# Altium project Knattebol PCB.PrjPcb
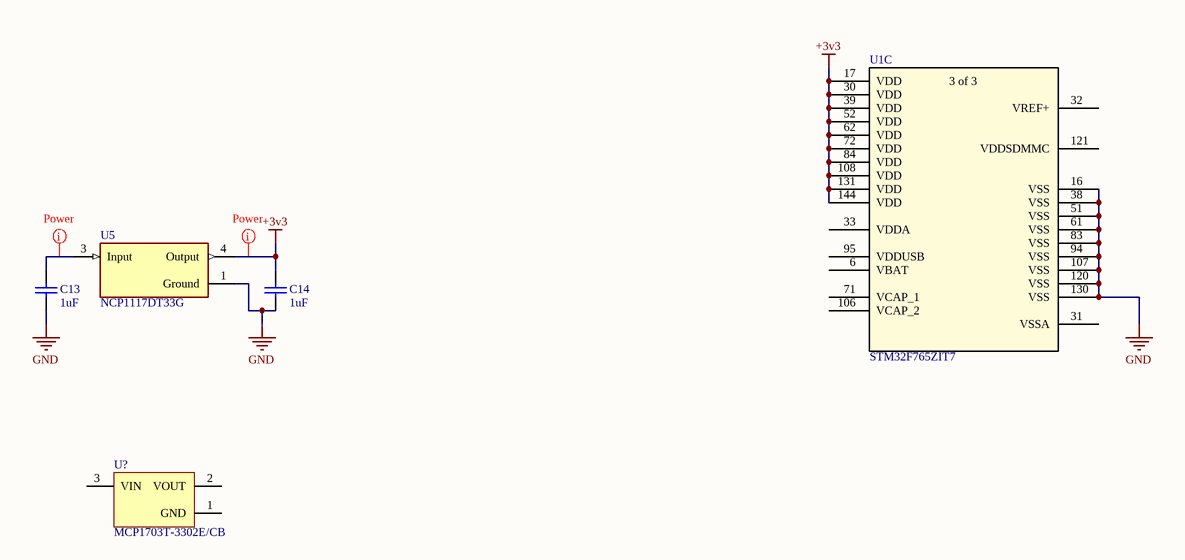
[diagram p0: Power.SchDoc]
3 sheets, 76 parts. Net scope: hierarchical (ports join the sheet entries above them; power ports are global).
Board file: PCB.PcbDoc
Sheets:
  Power.SchDoc
  Main.SchDoc
    DRV2 = Stepper-driver.SchDoc
    DRV3 = Stepper-driver.SchDoc
    DRV1 = Stepper-driver.SchDoc

## Sheet Power.SchDoc
size A4; SheetNumber: 3; SheetTotal: 3

### Parts
C13  1uF  [RAD-0.3]
C14  1uF  [RAD-0.3]
U1  STM32F765ZIT7  [LQFP-144_STM-M]  (part C of 3)
U5  NCP1117DT33G  [FP-369C-MFG]
U?  MCP1703T-3302E/CB  [SOT-23A-CB3_M]

### Nets
+3v3: C14.2 U1.17(VDD) U1.30(VDD) U1.39(VDD) U1.52(VDD) U1.62(VDD) U1.72(VDD) U1.84(VDD) U1.108(VDD) U1.131(VDD) U1.144(VDD) U5.4(Output)
GND: C13.1 C14.1 U1.16(VSS) U1.38(VSS) U1.51(VSS) U1.61(VSS) U1.83(VSS) U1.94(VSS) U1.107(VSS) U1.120(VSS) U1.130(VSS) U5.1(Ground)
NetC13_2: C13.2 U5.3(Input)

Not connected (* = marked no-connect by the designer): U1 6(VBAT) 31(VSSA) 32(VREF+) 33(VDDA) 71(VCAP_1) 95(VDDUSB) 106(VCAP_2) 121(VDDSDMMC); U? 1(GND) 2(VOUT) 3(VIN)

### Layout directives
net class Power; net class Power: NetC13_2
net class Power: +3v3

### Notes on the sheet
- (in symbol STM32F765ZIT7, part C) 3 of 3

### Library data of the parts
C13 C14 = Cap: Capacitor; Value: 100pF; Published: 8-Jun-2000; LatestRevisionDate: 17-Jul-2002; LatestRevisionNote: Re-released for DXP Platform.; PackageReference: RAD-0.3; Publisher: Altium Limited; PackageDescription: Radial Cap, Thru-Hole; 2 Leads; 0.3 in Pin Spacing
U1 = STM32F765ZIT7: No Description Available; Built_By: EMA_Jessica; Vendor: STMicroelectronics; SourceLibrary: Add_to_database_2020-10-19; Copyright: Copyright (C) 2018 Accelerated Designs. All rights reserved; Manufacturer_Part_Number: STM32F765ZIT7; RefDes: RefDes; Type: DEV
U5 = CMP-07128-000008-1: IC REG LINEAR 3.3V 1A DPAK; Manufacturer: ON Semiconductor; Dropout Voltage: 1.2V; Nominal Supply Current: 6mA; Number Of Outputs: 1; Max Supply Voltage: 20V; Max Junction Temp: +150°C; Min Supply Voltage: 2.4V; Accuracy Percentage: 1%; Output Type: Fixed; Standoff Height: 0mm; Package: 369C; Lead Free: Yes; Temperature Range Low: -55°C; Automotive: No; Digikey Description: IC REG LINEAR 3.3V 1A DPAK; ComponentLink2Description: Datasheet; Footprint Url: https://www.onsemi.com/pub/Collateral/369C.PDF; Output Voltage: 3.3V; Manufacturer Part Number: NCP1117DT33G; Device Class L2: Power Management ICs; RoHS: TRUE; Device Class L3: Voltage Regulators - Linear; Mouser Description: LDO Voltage Regulators 3.3V 1A Positive; Output Current: 1A; Ambient Temperature Range Low: 0°C; Height: 2.51mm; Octopart: https://octopart.com/ncp1117dt33g-on+semiconductor-1381653; Temperature Range High: +150°C; Temperature: -55°C to +150°C; Device Class L1: Integrated Circuits (ICs); ComponentLink2URL: https://www.onsemi.jp/PowerSolutions/document/NCP1117-D.PDF; Ambient Temperature Range High: +125°C; Category: IC
U? = CMP-0136-00759-1: 250 mA, 16V, Low Quiescent Current LDO Regulator, 3-Pin SOT-23A, Extended Temperature, Tape and Reel; PackageDescription: 3-Lead Plastic Small Outline Transistor (CB) [SOT-23A]; PackageVersion: revBB, Aug-2009; PackageReference: SOT-23A-CB3; DatasheetVersion: revD, Sep-2009

## Sheet Main.SchDoc
size 420 x 297 mm; SheetNumber: 2; SheetTotal: 2
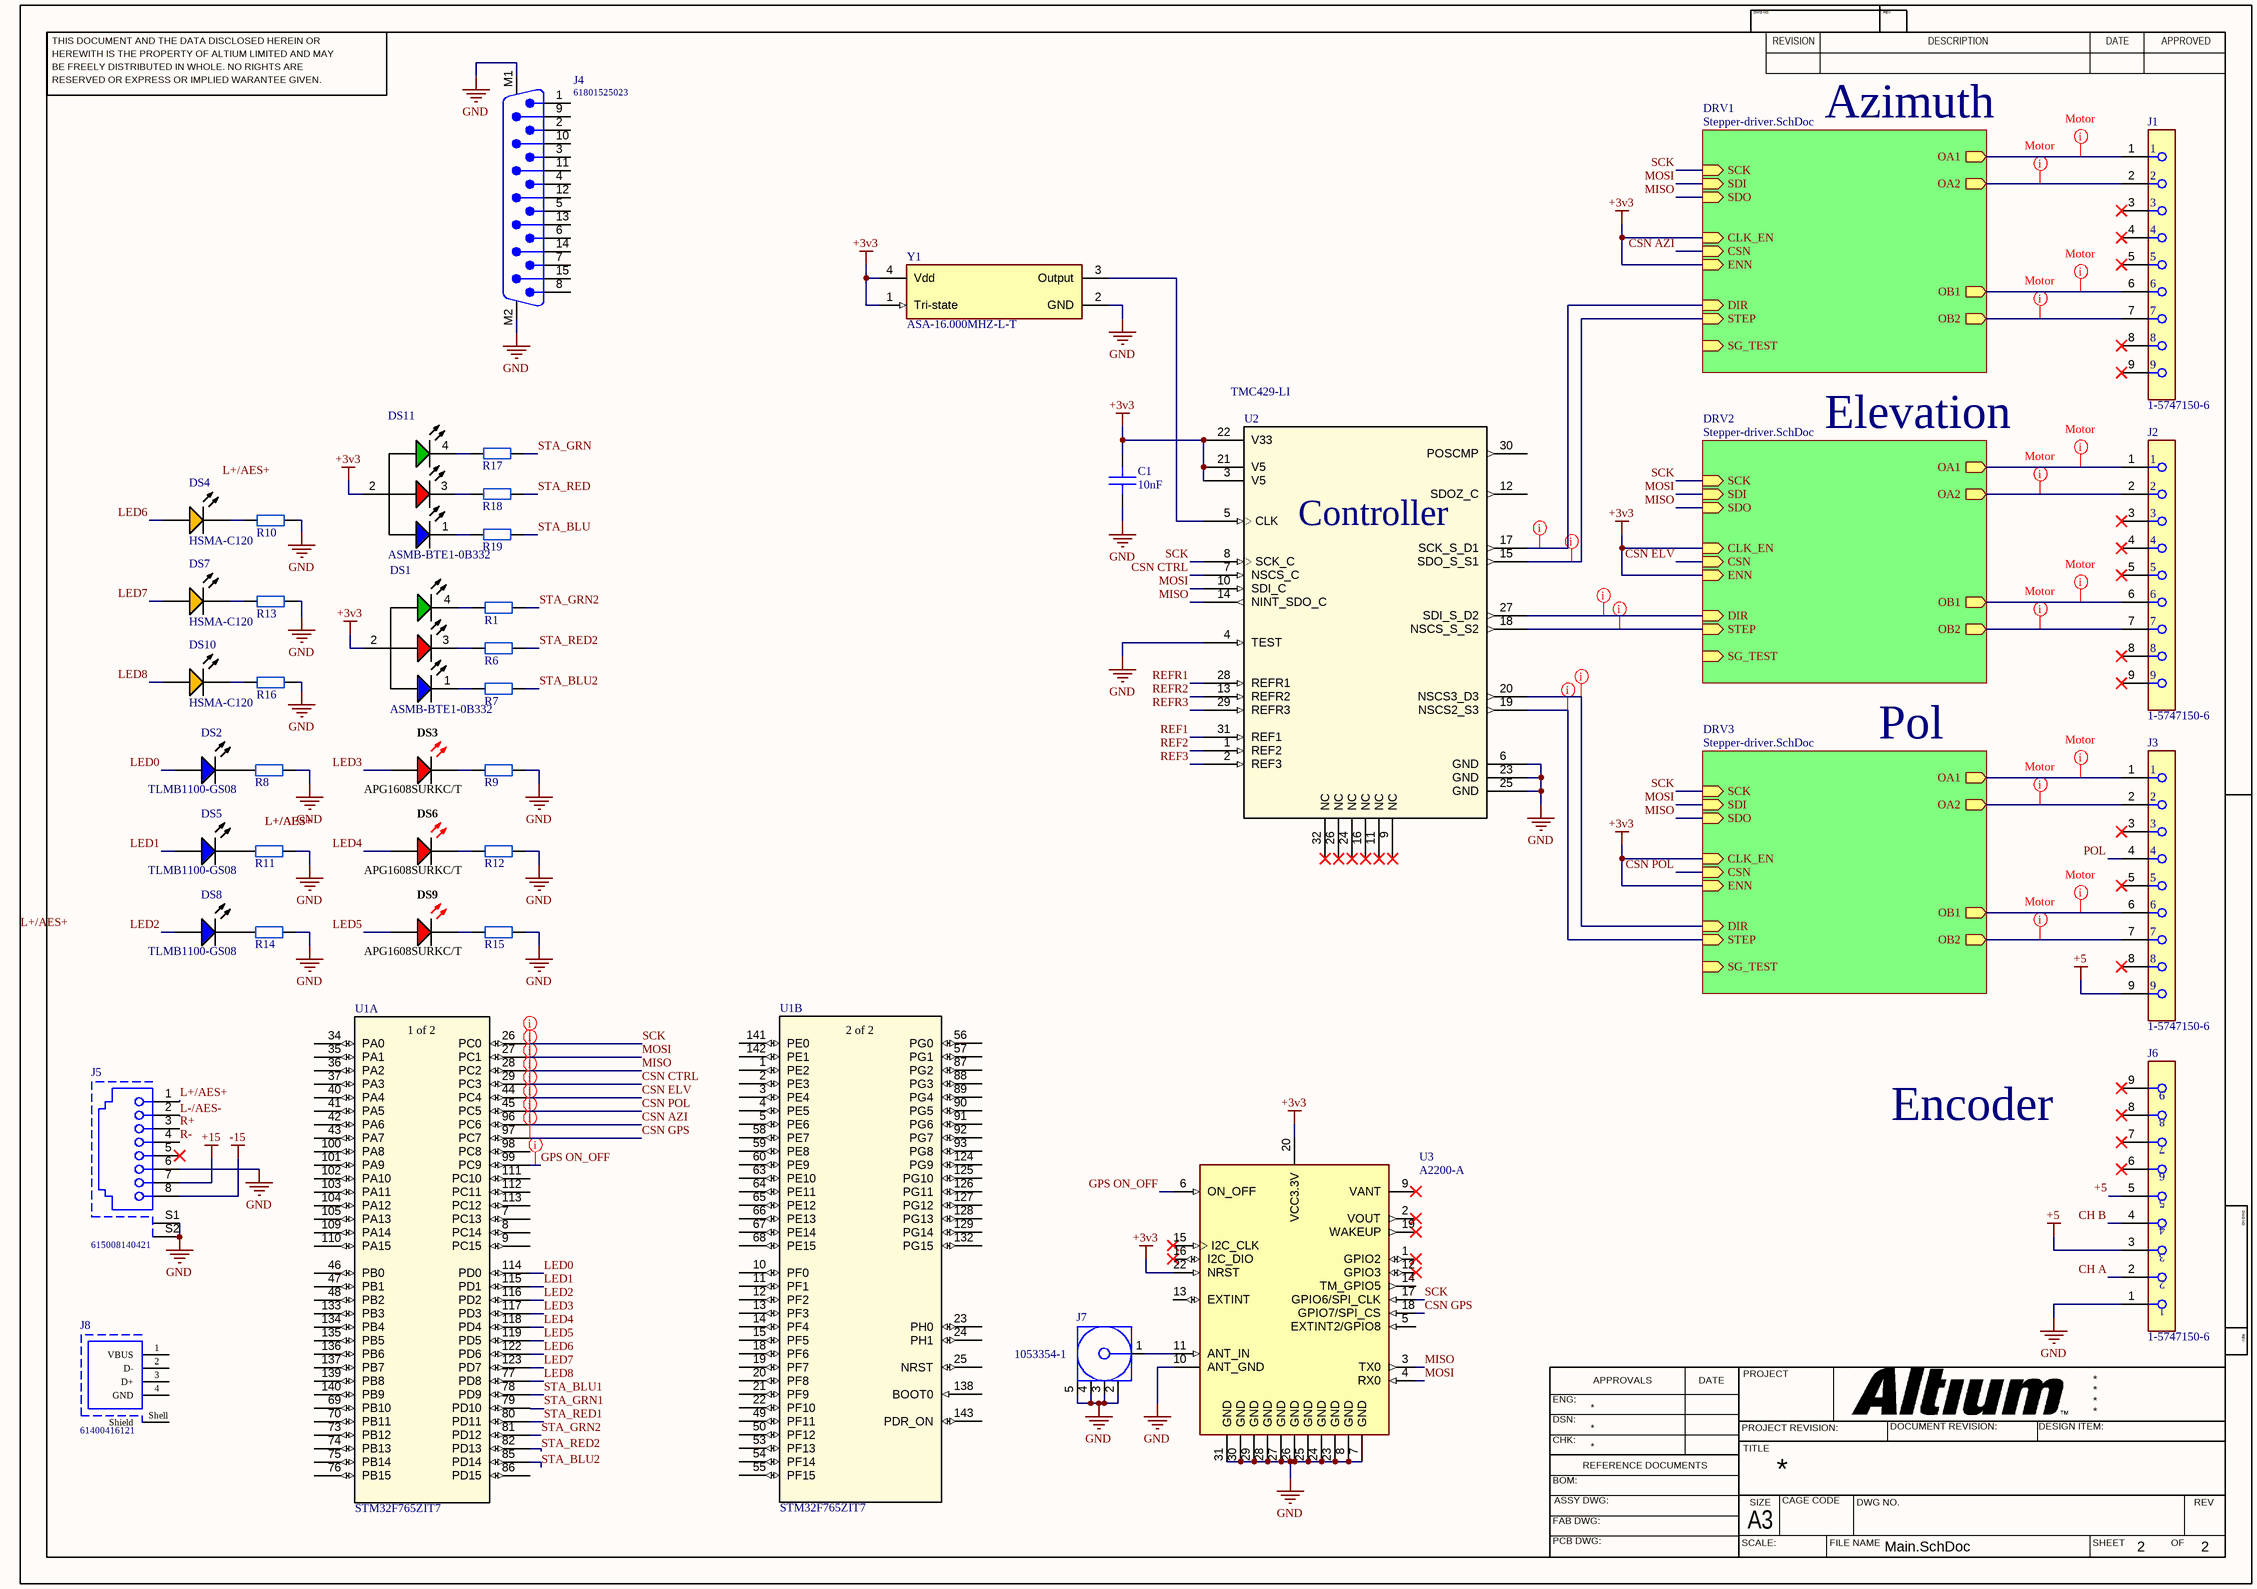
[diagram p1: Main.SchDoc]

### Parts
C1  value 10nF  [C0603 (1608)]  (hidden comment: Cap SMD)
DS1  ASMB-BTE1-0B332  [FP-ASMB-BTE1-0B332-MFG]
DS2  TLMB1100-GS08  [VISH-TLMX1100-2_V]
DS3  APG1608SURKC/T  [KING-LED0603-25-RED_V]
DS4  HSMA-C120  [AVAG-HSMA-C120-2_V]
DS5  TLMB1100-GS08  [VISH-TLMX1100-2_V]
DS6  APG1608SURKC/T  [KING-LED0603-25-RED_V]
DS7  HSMA-C120  [AVAG-HSMA-C120-2_V]
DS8  TLMB1100-GS08  [VISH-TLMX1100-2_V]
DS9  APG1608SURKC/T  [KING-LED0603-25-RED_V]
DS10  HSMA-C120  [AVAG-HSMA-C120-2_V]
DS11  ASMB-BTE1-0B332  [FP-ASMB-BTE1-0B332-MFG]
J1  1-5747150-6  [FP-1-5747150-6-MFG]
J2  1-5747150-6  [FP-1-5747150-6-MFG]
J3  1-5747150-6  [FP-1-5747150-6-MFG]
J4  61801525023  [61801525023]
J5  615008140421  [615008140421]
J6  1-5747150-6  [FP-1-5747150-6-MFG]
J7  1053354-1  [TECO-1053354-1_V]
J8  61400416121  [61400416121]
R1  Res  [R0603 (1608)]  (value not drawn)
R6  Res  [R0603 (1608)]  (value not drawn)
R7  Res  [R0603 (1608)]  (value not drawn)
R8  Res  [R0603 (1608)]  (value not drawn)
R9  Res  [R0603 (1608)]  (value not drawn)
R10  Res  [R0603 (1608)]  (value not drawn)
R11  Res  [R0603 (1608)]  (value not drawn)
R12  Res  [R0603 (1608)]  (value not drawn)
R13  Res  [R0603 (1608)]  (value not drawn)
R14  Res  [R0603 (1608)]  (value not drawn)
R15  Res  [R0603 (1608)]  (value not drawn)
R16  Res  [R0603 (1608)]  (value not drawn)
R17  Res  [R0603 (1608)]  (value not drawn)
R18  Res  [R0603 (1608)]  (value not drawn)
R19  Res  [R0603 (1608)]  (value not drawn)
U1  STM32F765ZIT7  [LQFP-144_STM-M]  (parts A,B of 3)
U2  TMC429-LI  [QFN32_5X5_TRI-M]
U3  A2200-A  [XCVR_A2200-A]
Y1  ASA-16.000MHZ-L-T  [FP-ASA-MFG]

### Sub-sheets
DRV1 = Stepper-driver.SchDoc: OA1 (out), OA2 (out), OB1 (out), OB2 (out), SCK (in), SDI (in), SDO (in), CSN (in), ENN (in), DIR (in), STEP (in), SG_TEST (in), CLK_EN (in)
DRV2 = Stepper-driver.SchDoc: OA1 (out), OA2 (out), OB1 (out), OB2 (out), SCK (in), SDI (in), SDO (in), CSN (in), ENN (in), DIR (in), STEP (in), SG_TEST (in), CLK_EN (in)
DRV3 = Stepper-driver.SchDoc: OA1 (out), OA2 (out), OB1 (out), OB2 (out), SCK (in), SDI (in), SDO (in), CSN (in), ENN (in), DIR (in), STEP (in), SG_TEST (in), CLK_EN (in)

### Nets
+3v3: C1.2 DS1.2(Common_Anode) DS11.2(Common_Anode) U2.3(V5) U2.21(V5) U2.22(V33) U3.20(VCC3.3V) U3.22(NRST) Y1.1(Tri-state) Y1.4(Vdd) ; sheet DRV2/ENN, sheet DRV2/CLK_EN, sheet DRV3/ENN, sheet DRV3/CLK_EN, sheet DRV1/ENN, sheet DRV1/CLK_EN
+5: J3.9 J6.3 J6.5
+15: J5.7
-15: J5.8
GND: C1.1 J4.M1 J4.M2 J5.6 J5.S1 J5.S2 J6.1 J7.2 J7.3 J7.4 J7.5 R8.2 R9.2 R10.2 R11.2 R12.2 R13.2 R14.2 R15.2 R16.2 U2.4(TEST) U2.6(GND) U2.23(GND) U2.25(GND) U3.7(GND) U3.8(GND) U3.10(ANT_GND) U3.23(GND) U3.24(GND) U3.25(GND) U3.26(GND) U3.27(GND) U3.28(GND) U3.29(GND) U3.30(GND) U3.31(GND) Y1.2(GND)
CH A: J6.2
CH B: J6.4
CSN AZI: U1.96(PC6) ; sheet DRV1/CSN
CSN CTRL: U1.29(PC3) U2.7(NSCS_C)
CSN ELV: U1.44(PC4) ; sheet DRV2/CSN
CSN GPS: U1.97(PC7) U3.18(GPIO7/SPI_CS)
CSN POL: U1.45(PC5) ; sheet DRV3/CSN
GPS ON_OFF: U1.99(PC9) U3.6(ON_OFF)
L+/AES+: J5.1
L-/AES-: J5.2
LED0: DS2.1(A) U1.114(PD0)
LED1: DS5.1(A) U1.115(PD1)
LED2: DS8.1(A) U1.116(PD2)
LED3: DS3.1(A) U1.117(PD3)
LED4: DS6.1(A) U1.118(PD4)
LED5: DS9.1(A) U1.119(PD5)
LED6: DS4.1(A) U1.122(PD6)
LED7: DS7.1(A) U1.123(PD7)
LED8: DS10.1(A) U1.77(PD8)
MISO: U1.28(PC2) U2.14(NINT_SDO_C) U3.3(TX0) ; sheet DRV2/SDO, sheet DRV3/SDO, sheet DRV1/SDO
MOSI: U1.27(PC1) U2.10(SDI_C) U3.4(RX0) ; sheet DRV2/SDI, sheet DRV3/SDI, sheet DRV1/SDI
POL: J3.4
R+: J5.3
R-: J5.4
REF1: U2.31(REF1)
REF2: U2.1(REF2)
REF3: U2.2(REF3)
REFR1: U2.28(REFR1)
REFR2: U2.13(REFR2)
REFR3: U2.29(REFR3)
SCK: U1.26(PC0) U2.8(SCK_C) U3.17(GPIO6/SPI_CLK) ; sheet DRV2/SCK, sheet DRV3/SCK, sheet DRV1/SCK
STA_BLU: R19.2
STA_BLU1: U1.78(PD9)
STA_BLU2: R7.2 U1.85(PD14)
STA_GRN: R17.2
STA_GRN2: R1.2 U1.81(PD12)
STA_RED: R18.2
STA_RED1: U1.80(PD11)
STA_RED2: R6.2 U1.82(PD13)
NetDS1_1: DS1.1(Cathode(Blue)) R7.1
NetDS1_3: DS1.3(Cathode(Red)) R6.1
NetDS1_4: DS1.4(Cathode(Green)) R1.1
NetDS2_2: DS2.2(K) R8.1
NetDS3_2: DS3.2(K) R9.1
NetDS4_2: DS4.2(K) R10.1
NetDS5_2: DS5.2(K) R11.1
NetDS6_2: DS6.2(K) R12.1
NetDS7_2: DS7.2(K) R13.1
NetDS8_2: DS8.2(K) R14.1
NetDS9_2: DS9.2(K) R15.1
NetDS10_2: DS10.2(K) R16.1
NetDS11_1: DS11.1(Cathode(Blue)) R19.1
NetDS11_3: DS11.3(Cathode(Red)) R18.1
NetDS11_4: DS11.4(Cathode(Green)) R17.1
NetJ1_1: J1.1 ; sheet DRV1/OA1
NetJ1_2: J1.2 ; sheet DRV1/OA2
NetJ1_6: J1.6 ; sheet DRV1/OB1
NetJ1_7: J1.7 ; sheet DRV1/OB2
NetJ2_1: J2.1 ; sheet DRV2/OA1
NetJ2_2: J2.2 ; sheet DRV2/OA2
NetJ2_6: J2.6 ; sheet DRV2/OB1
NetJ2_7: J2.7 ; sheet DRV2/OB2
NetJ3_1: J3.1 ; sheet DRV3/OA1
NetJ3_2: J3.2 ; sheet DRV3/OA2
NetJ3_6: J3.6 ; sheet DRV3/OB1
NetJ3_7: J3.7 ; sheet DRV3/OB2
NetJ7_1: J7.1 U3.11(ANT_IN)
NetU2_5: U2.5(CLK) Y1.3(Output)
NetU2_15: U2.15(SDO_S_S1) ; sheet DRV1/STEP
NetU2_17: U2.17(SCK_S_D1) ; sheet DRV1/DIR
NetU2_18: U2.18(NSCS_S_S2) ; sheet DRV2/STEP
NetU2_19: U2.19(NSCS2_S3) ; sheet DRV3/STEP
NetU2_20: U2.20(NSCS3_D3) ; sheet DRV3/DIR
NetU2_27: U2.27(SDI_S_D2) ; sheet DRV2/DIR

Not connected (* = marked no-connect by the designer): J1 3* 4* 5* 8* 9*; J2 3* 4* 5* 8* 9*; J3 3* 5* 8*; J4 1 2 3 4 5 6 7 8 9 10 11 12 13 14 15; J5 5*; J6 6* 7* 8* 9*; J8 1(VBUS) 2(D-) 3(D+) 4(GND) Shell(Shield); U1 1(PE2) 2(PE3) 3(PE4) 4(PE5) 5(PE6) 7(PC13) 8(PC14) 9(PC15) 10(PF0) 11(PF1) 12(PF2) 13(PF3) 14(PF4) 15(PF5) 18(PF6) 19(PF7) 20(PF8) 21(PF9) 22(PF10) 23(PH0) 24(PH1) 25(NRST) 34(PA0) 35(PA1) 36(PA2) 37(PA3) 40(PA4) 41(PA5) 42(PA6) 43(PA7) 46(PB0) 47(PB1) 48(PB2) 49(PF11) 50(PF12) 53(PF13) 54(PF14) 55(PF15) 56(PG0) 57(PG1) 58(PE7) 59(PE8) 60(PE9) 63(PE10) 64(PE11) 65(PE12) 66(PE13) 67(PE14) 68(PE15) 69(PB10) 70(PB11) 73(PB12) 74(PB13) 75(PB14) 76(PB15) 79(PD10) 86(PD15) 87(PG2) 88(PG3) 89(PG4) 90(PG5) 91(PG6) 92(PG7) 93(PG8) 98(PC8) 100(PA8) 101(PA9) 102(PA10) 103(PA11) 104(PA12) 105(PA13) 109(PA14) 110(PA15) 111(PC10) 112(PC11) 113(PC12) 124(PG9) 125(PG10) 126(PG11) 127(PG12) 128(PG13) 129(PG14) 132(PG15) 133(PB3) 134(PB4) 135(PB5) 136(PB6) 137(PB7) 138(BOOT0) 139(PB8) 140(PB9) 141(PE0) 142(PE1) 143(PDR_ON); U2 9(NC)* 11(NC)* 12(SDOZ_C) 16(NC)* 24(NC)* 26(NC)* 30(POSCMP) 32(NC)*; U3 1(GPIO2)* 2(VOUT)* 5(EXTINT2/GPIO8) 9(VANT)* 12(GPIO3)* 13(EXTINT) 14(TM_GPIO5) 15(I2C_CLK)* 16(I2C_DIO)* 19(WAKEUP)*

### Layout directives
net class Motor: NetJ1_2, NetJ1_6, NetJ1_7, NetJ2_1, NetJ2_2, NetJ2_6, NetJ2_7, NetJ3_1, NetJ3_2, NetJ3_6, NetJ3_7
net class Power; net class Motor: NetJ1_1
net class Signal HS: CSN AZI, CSN CTRL, CSN ELV, CSN GPS, CSN POL, GPS ON_OFF, MISO, MOSI, NetU2_15, NetU2_17, NetU2_18, NetU2_19, NetU2_20, NetU2_27, SCK

### Notes on the sheet
- Azimuth
- Elevation
- (near U2) Controller
- Pol
- Encoder
- Labels drawn without touching a wire or pin: L+/AES+
- THIS DOCUMENT AND THE DATA DISCLOSED HEREIN OR
- HEREWITH IS THE PROPERTY OF ALTIUM LIMITED AND MAY
- DWG NO:
- REVISION
- REV:
- DESCRIPTION
- DATE
- APPROVED
- BE FREELY DISTRIBUTED IN WHOLE. NO RIGHTS ARE
- RESERVED OR EXPRESS OR IMPLIED WARANTEE GIVEN.
- ENG:
- APPROVALS
- PROJECT
- DSN:
- CHK:
- REFERENCE DOCUMENTS
- PROJECT REVISION:
- TITLE
- DOCUMENT REVISION:
- DESIGN ITEM:
- BOM:
- FAB DWG:
- PCB DWG:
- ASSY DWG:
- SCALE:
- A3
- SIZE
- CAGE CODE
- FILE NAME
- DWG NO.
- SHEET
- OF
- REV
- (in symbol STM32F765ZIT7, part A) 1 of 2
- (in symbol STM32F765ZIT7, part B) 2 of 2

### Library data of the parts
DS1 DS11 = ASMB-BTE1-0B332 RGB LED: LED RGB DIFFUSED 4PLCC SMD; Manufacturer: Broadcom; Led Orientation: Top View; Colour: Blue, Green, Red; Viewing Angle: 110°; Power Dissipation: 90/90/78mW; Forward Current: 20mA; Max Junction Temp: +110°C; Wavelength: 469/529/622nm; Luminous Intensity: 350/1500/630mcd; Forward Voltage: 3.1/3.1/2.1V; Reverse Voltage: 4V; Peak Emmision Wavelength: 464/521/629nm; Package: 0; Temperature Range High: +100°C; Device Class L1: Optoelectronics; Device Class L2: LEDs; Temperature Range Low: -40°C; Temperature: -40°C to +100°C; Category: Diode; Device Class L3: unset; Manufacturer Part Number: ASMB-BTE1-0B332; Digikey Description: LED RGB DIFFUSED 4PLCC SMD; Lead Free: Yes; ComponentLink2Description: Datasheet; RoHS: TRUE; Automotive: No; Height: 2.1mm; ComponentLink2URL: https://docs.broadcom.com/docs/AV02-4236EN; Octopart: https://octopart.com/asmb-bte1-0b332-broadcom-71127192
DS2 DS5 DS8 = CMP-1666-00028-1: Blue LED, 10 mA, 3.9 V, -40 to 100 degC, 2-Pin SMD (0603), RoHS, Tape and Reel; Tolerance: 10%; Voltage Rating: 100 V; Capacitance: 10 nF; Type (Capacitors): X7R; Case\Package: Radial; ComponentLink1Description: Manufacturer URL; REACH SVHC: No SVHC; Package Quantity: 500; PackageDescription: 2-Pin Surface Mount Device, Body 1.6 x 0.8 mm; Pins: 2; ComponentLink2URL: http://download.siliconexpert.com/pdfs/2016/8/7/12/43/26/667/vsh_/manual/379263299541529tlmb1100.pdf; RoHSCompliant: true; Lead Pitch: 2.54 mm; Height: 2.54 mm; DatasheetVersion: Rev. 2.7, 03/2016; Length: 5.33 mm; ComponentLink1URL: http://www.vishay.com/; Min Operating Temperature: -55 degC; PackageReference: 0603; Packaging: Bulk; ComponentLink2Description: Datasheet; Max Operating Temperature: 125 degC; Radiation Hardening: No; Width: 3.81 mm; Mount: Through Hole
DS3 DS6 DS9 = CMP-0404-00004-1: Ultra Thin Hyper Red SMD Chip LED Lamp, 2 to 2.5 V, -40 to 85 degC, Body 1.6 x 0.8 mm, 0.28 mm Thickness, RoHS, Tape and Reel; Manufacturer: Kingbright; Dice: Hyper Red (AlGaInP); IR (Max): 10 uA; Luminous Intensity mcd @ 20 mA (Min.): 55; Lens Type: Water Clear; Viewing Angle: 120; Luminous Intensity mcd @ 20 mA (Typ.): 110; ComponentLink2Description: Datasheet; ComponentLink3URL: http://www.kingbrightusa.com/images/catalog/SPEC/APG1608SURKC-T.pdf; Packing: Tape and Reel; Mounting Technology: Surface Mount; PackageVersion: Rev. V.5A; ComponentLink1Description: Manufacturer URL; ComponentLink2URL: http://www.kingbrightusa.com/images/catalog/SPEC/APG1608SURKC-T.pdf; ComponentLink3Description: Package Specification; PackageDescription: 2-Pin SMT, Body 1.6 x 0.8 mm, 0.28mm Thickness, Red; PackageReference: LED0603-25-RED; DatasheetVersion: Rev. V.5A; Operating Temperature: -40 to 85 degC; PartNumber: APG1608SURKC/T; ComponentLink1URL: http://www.kingbrightusa.com/; Forward Voltage: 2 to 2.5 V; RoHS: TRUE
DS4 DS7 DS10 = CMP-2000-06419-1: High Performance Chip LED, 1.9 V, -40 to 85 degC, 2-Pin SMD (0603), RoHS, Tape and Reel; Manufacturer: Avago; DELETED: Compliant; Chip Material: AlGaInP; High Brightness: No; Product Length (mm): 1.6mm; Forward Voltage: 2.4V; Dominant Wave Length: 592nm; Product Height (mm): 1mm; Viewing Angle: 155deg; Luminous Intensity: 90mcd; Number of  Elements: 1; Reverse Voltage: 5V; Forward Current: 25mA; Power Dissipation: 60W; Test Current (It): 20mA; Peak Wavelength: 595nm; Type: Uni-Color; Product Depth (mm): 0.6mm; Shape Type: Rectangular; Emitting Color: Amber; Operating Temp Range: -40Cto85C; Datasheet URL: http://docs.avagotech.com/docs/AV02-0975EN?_ga=1.69010961.1008964631.1477559468; Main Category: ChipLED; Package Description: 2-Pin Surface Mount Device, Body 1.6 x 0.6 mm; Mounting Technology: SurfaceMount; Mounting: SurfaceMount; Manufacturer URL: http://www.avagotech.com/; Package Reference: 0603; Operating Temperature Classification: Industrial; Pin Count: 2; Datasheet Version: 05/2010; Lens Dimensions: 1.2x0.6x0.6mm; Package Type: ChipLed; Rad Hardened: No; Packaging: TapeandReel; Lum Intensity: 90mcd
J1-J3 J6 = CMP-03367-000009-1: CONN D-SUB RCPT 9POS VERT SOLDER; Manufacturer: TE Connectivity; Is Female: yes; Current Rating: 6A; Conn Orientation: Vertical; Conn Gender: Female; Shielding: false; Number Of Contacts: 9; Pitch: 2.74mm; ComponentLink2URL: https://www.te.com/usa-en/product-1-5747150-6.html?te_bu=Cor&te_type=other&te_campaign=oct_glo_cor-oct-global-oth-prtnr-fy19-oct-octo-buy-bom_sma-298_2&elqCampaignId=35216; Manufacturer Part Number: 1-5747150-6; Temperature: -55°C to +105°C; Mouser Description: D-Sub Standard Connectors RECP FRNT MTL SHL 9P female screwlocks; Octopart: https://octopart.com/1-5747150-6-te+connectivity-39500344; Category: Conn; Automotive: No; Package: 1-5747150-6; Device Class L3: unset; Contact Material: Gold,Nickel; Lead Free: Yes; Height: 12.54mm; RoHS: TRUE; ComponentLink2Description: Datasheet; Device Class L2: D-Sub Connectors; Device Class L1: Connectors; Digikey Description: CONN D-SUB RCPT 9POS VERT SOLDER; Temperature Range High: +105°C; Temperature Range Low: -55°C
J4 = CMP-1502-00277-1: Male PCB Connector WR-DSUB, Vertical, 15 pins; Manufacturer: Wurth Elektronik; Working Voltage: 125VAC; Pin Number: 15; Rated Current: 3A; Contact Resistance: 30mOhm; Datasheet URL: https://katalog.we-online.de/em/datasheet/6180xx25023.pdf; Package Reference: 61801525023; Operating Temperature: -40to85degC; Publisher: WurthElektronik; Orientation: Vertical; Gender: Male; Manufacturer URL: http://www.we-online.de; Mounting Technology: THT; Packaging: Tray; Part Number: 61801525023
J5 = CMP-1502-01733-1: Modular Jack WR-MJ, Rear Post, Shielded, Vertical Entry, THT, 8P8C; Manufacturer: Wurth Elektronik; Compliance: Leadfree/RoHS; Working Voltage: 120VAC; Port: 1x1; Withstanding Voltage: 1000VAC; Rated Current: 1.5A; Contact Resistance: 20mOhm; Datasheet URL: https://katalog.we-online.com/em/datasheet/615008140421.pdf; Entrance: Vertical; Packaging: Tray; Part Number: 615008140421; Publisher: WurthElektronik; Operating Temperature: -40to85degC; Manufacturer URL: http://www.we-online.de; Mounting Technology: THT; Package Reference: 615008140421; Pin Number: 8P8C
J7 = CMP-2000-05830-1: Female Coaxial Connector, Pitch 2.55 mm, Height 9.5 mm, Tail Length 3.9 mm, RoHS, Bulk; Manufacturer: TE Connectivity; Dynamic Catalog: SMA; Impedance: 50Ohm; Contact Termination: Solder; Connector Type: Jack,FemaleSockets; 3D Model: 1053354-1.pdf; Other Names: 2062000000 / A30046; Datasheet Version: Rev. B, 05/2011; Package Reference: 1053354-1; RoHS Information: 1053354-1StatementofCompliance; Series: SMA; Connector Style: SMA; Family: CoaxialConnectors(RF); Category: Connectors,Interconnects; Fastening Type: Threaded; Standard Package: 125; Mounting Type: ThroughHole; Packaging: Bulk; Datasheet URL: http://www.te.com/commerce/DocumentDelivery/DDEController?Action=srchrtrv&DocNm=1053354&DocType=Customer+Drawing&DocLang=English; Mounting Technology: ThroughHole; Manufacturer URL: http://www.te.com/; Package Description: Female Coaxial Connector, Pitch 2.55 mm, Height 9.5 mm, Tail Length 3.9 mm
J8 = CMP-1502-03243-1: USB 2.0 Type B Receptacle WR-COM, Horizontal, THT, with Pads and Pegs; Manufacturer: Wurth Elektronik; Contact Resistance: 20mOhm; Rated Current: 1.5A; Working Voltage: 30VAC; Package Reference: 61400416121; Part Number: 61400416121; Packaging: Tray; Mounting Technology: THT; Gender: Receptacle; Datasheet URL: https://katalog.we-online.de/em/datasheet/61400416121.pdf; Publisher: WurthElektronik; Orientation: Horizontal; Connector Type: USB2.0TypeB; Operating Temperature: -40to105degC; Manufacturer URL: http://www.we-online.de
R1 R6-R19 = Resistor EU
U1 = STM32F765ZIT7: as U1 on sheet Power; Copyright: Copyright (C) 2018 Accelerated Designs. All rights reserved; Manufacturer_Part_Number: STM32F765ZIT7; RefDes: RefDes; Type: DEV
U2 = TMC429-LI: No Description Available; Built_By: EMA_Jessica; Vendor: TRINAMIC; SourceLibrary: Trinamic_2018-10-17; Copyright: Copyright (C) 2016 Accelerated Designs. All rights reserved; Manufacturer_Part_Number: TMC429-LI; RefDes: RefDes; Type: DEV
U3 = A2200-A: SiRFstarIVâ„¢ RF Receiver GPS 1.575GHz -163dBm 115.2kbps Module; MF: Maestro Wireless; SnapEDA_Link: https://www.snapeda.com/parts/A2200-A/Maestro%20Wireless%20Solutions/view-part/51723/?ref=snap; Availability: Unavailable; MP: A2200-A; Price: None; Value: *; Package: Module Maestro Wireless
Y1 = CMP-27762-000001-1: XTAL OSC XO 16.0000MHZ HCMOS SMD; Manufacturer: Abracon; Max Supply Current: 5mA; Max Supply Voltage: 3.66V; Load Capacitance: 15pF; Stability: 50ppm; Frequency: 16MHz; Min Supply Voltage: 2.97V; Category: Crys; Package: ASA; Temperature Range High: +85°C; Device Class L1: Passive Components; Octopart: https://octopart.com/asa-16.000mhz-l-t-abracon-21707822; Device Class L3: Oscillators; Temperature Range Low: -40°C; ComponentLink2Description: Datasheet; Mouser Description: Standard Clock Oscillators 16.000MHz 3.3V -40C +85C; Height: 0.8mm; Series: ASA; Automotive: No; Device Class L2: Crystals / Oscillators; Manufacturer Part Number: ASA-16.000MHZ-L-T; ComponentLink2URL: https://abracon.com/Oscillators/ASA.pdf; Digikey Description: XTAL OSC XO 16.0000MHZ HCMOS SMD; Footprint Url: https://abracon.com/Support/PackageDrawing/Oscillators/ASA.PDF; Temperature: -40°C to +85°C; RoHS: TRUE; Lead Free: Yes

## Sheet Stepper-driver.SchDoc
size A4; SheetNumber: 2; SheetTotal: 3
Used 3 times, as channels DRV2, DRV3, DRV1. Parts and nets are listed once, with the designators drawn on the sheet.
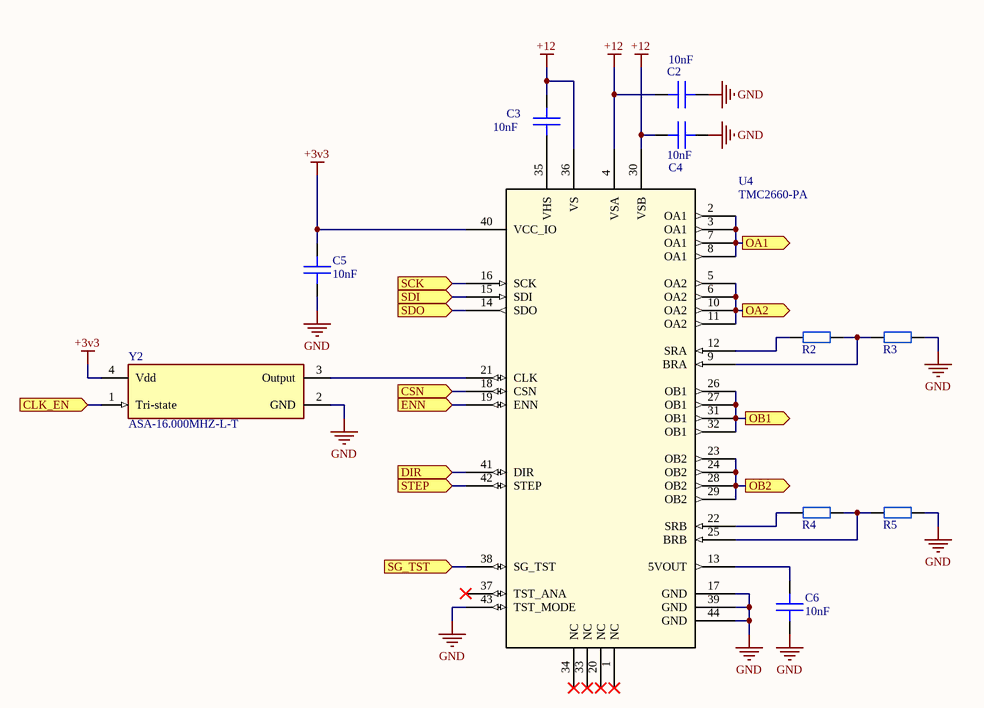
[diagram p2: Stepper-driver.SchDoc]

### Parts
C2  value 10nF  [C0603 (1608)]  (hidden comment: Cap SMD)
C3  value 10nF  [C0603 (1608)]  (hidden comment: Cap SMD)
C4  value 10nF  [C0603 (1608)]  (hidden comment: Cap SMD)
C5  value 10nF  [C0603 (1608)]  (hidden comment: Cap SMD)
C6  value 10nF  [C0603 (1608)]  (hidden comment: Cap SMD)
R2  Res  [R0603 (1608)]  (value not drawn)
R3  Res  [R0603 (1608)]  (value not drawn)
R4  Res  [R0603 (1608)]  (value not drawn)
R5  Res  [R0603 (1608)]  (value not drawn)
U4  TMC2660-PA  [LQFP44_12X12_TRI-M]
Y2  ASA-16.000MHZ-L-T  [FP-ASA-MFG]

### Ports
CLK_EN (in), CSN (in), DIR (in), ENN (in), OA1 (out), OA2 (out), OB1 (out), OB2 (out), SCK (in), SDI (in), SDO (in), SG_TST (in), STEP (in)

### Nets
+3v3: C5.2 U4.40(VCC_IO) Y2.4(Vdd)
+12: C2.2 C3.1 C4.2 U4.4(VSA) U4.30(VSB) U4.36(VS)
GND: C2.1 C4.1 C5.1 C6.1 R3.2 R5.2 U4.17(GND) U4.39(GND) U4.43(TST_MODE) U4.44(GND) Y2.2(GND)
CLK_EN: Y2.1(Tri-state) ; port CLK_EN
CSN: U4.18(CSN) ; port CSN
DIR: U4.41(DIR) ; port DIR
ENN: U4.19(ENN) ; port ENN
OA1: U4.2(OA1) U4.3(OA1) U4.7(OA1) U4.8(OA1) ; port OA1
OA2: U4.5(OA2) U4.6(OA2) U4.10(OA2) U4.11(OA2) ; port OA2
OB1: U4.26(OB1) U4.27(OB1) U4.31(OB1) U4.32(OB1) ; port OB1
OB2: U4.23(OB2) U4.24(OB2) U4.28(OB2) U4.29(OB2) ; port OB2
SCK: U4.16(SCK) ; port SCK
SDI: U4.15(SDI) ; port SDI
SDO: U4.14(SDO) ; port SDO
SG_TST: U4.38(SG_TST) ; port SG_TST
STEP: U4.42(STEP) ; port STEP
NetC3_2: C3.2 U4.35(VHS)
NetC6_2: C6.2 U4.13(5VOUT)
NetR2_1: R2.1 U4.12(SRA)
NetR2_2: R2.2 R3.1 U4.9(BRA)
NetR4_1: R4.1 U4.22(SRB)
NetR4_2: R4.2 R5.1 U4.25(BRB)
NetU4_21: U4.21(CLK) Y2.3(Output)

Not connected (* = marked no-connect by the designer): U4 1(NC)* 20(NC)* 33(NC)* 34(NC)* 37(TST_ANA)*

### Channels
DRV2: designators end in _DRV2; ports CLK_EN=+3v3 CSN=CSN ELV DIR=NetU2_27 ENN=+3v3 OA1=NetJ2_1 OA2=NetJ2_2 OB1=NetJ2_6 OB2=NetJ2_7 SCK=SCK SDI=MOSI SDO=MISO SG_TST=NetU4_DRV2_38 STEP=NetU2_18
DRV3: designators end in _DRV3; ports CLK_EN=+3v3 CSN=CSN POL DIR=NetU2_20 ENN=+3v3 OA1=NetJ3_1 OA2=NetJ3_2 OB1=NetJ3_6 OB2=NetJ3_7 SCK=SCK SDI=MOSI SDO=MISO SG_TST=NetU4_DRV3_38 STEP=NetU2_19
DRV1: designators end in _DRV1; ports CLK_EN=+3v3 CSN=CSN AZI DIR=NetU2_17 ENN=+3v3 OA1=NetJ1_1 OA2=NetJ1_2 OB1=NetJ1_6 OB2=NetJ1_7 SCK=SCK SDI=MOSI SDO=MISO SG_TST=NetU4_DRV1_38 STEP=NetU2_15

### Library data of the parts
R2-R5 = Resistor EU
U4 = TMC2660-PA: No Description Available; Built_By: EMA_Jessica; Vendor: TRINAMIC; SourceLibrary: Trinamic_2018-10-17; Copyright: Copyright (C) 2016 Accelerated Designs. All rights reserved; Manufacturer_Part_Number: TMC2660-PA; RefDes: RefDes; Type: DEV
Y2 = CMP-27762-000001-1: as Y1 on sheet Main; Category: Crys; Package: ASA; Temperature Range High: +85°C; Device Class L1: Passive Components; Octopart: https://octopart.com/asa-16.000mhz-l-t-abracon-21707822; Device Class L3: Oscillators; Temperature Range Low: -40°C; ComponentLink2Description: Datasheet; Mouser Description: Standard Clock Oscillators 16.000MHz 3.3V -40C +85C; Height: 0.8mm; Series: ASA; Automotive: No; Device Class L2: Crystals / Oscillators; Manufacturer Part Number: ASA-16.000MHZ-L-T; ComponentLink2URL: https://abracon.com/Oscillators/ASA.pdf; Digikey Description: XTAL OSC XO 16.0000MHZ HCMOS SMD; Footprint Url: https://abracon.com/Support/PackageDrawing/Oscillators/ASA.PDF; Temperature: -40°C to +85°C; RoHS: TRUE; Lead Free: Yes

## Nets that join several sheets
+3v3: Power (12 pins), Main (10 pins), DRV2 (5 pins), DRV3 (5 pins), DRV1 (5 pins)
+12: DRV2 (6 pins), DRV3 (6 pins), DRV1 (6 pins)
GND: Power (12 pins), Main (37 pins), DRV2 (11 pins), DRV3 (11 pins), DRV1 (11 pins)
CSN AZI: Main (U1.96), DRV1 (U4_DRV1.18)
CSN ELV: Main (U1.44), DRV2 (U4_DRV2.18)
CSN POL: Main (U1.45), DRV3 (U4_DRV3.18)
MISO: Main (U1.28 U2.14 U3.3), DRV2 (U4_DRV2.14), DRV3 (U4_DRV3.14), DRV1 (U4_DRV1.14)
MOSI: Main (U1.27 U2.10 U3.4), DRV2 (U4_DRV2.15), DRV3 (U4_DRV3.15), DRV1 (U4_DRV1.15)
NetJ1_1: Main (J1.1), DRV1 (U4_DRV1.2 U4_DRV1.3 U4_DRV1.7 U4_DRV1.8)
NetJ1_2: Main (J1.2), DRV1 (U4_DRV1.5 U4_DRV1.6 U4_DRV1.10 U4_DRV1.11)
NetJ1_6: Main (J1.6), DRV1 (U4_DRV1.26 U4_DRV1.27 U4_DRV1.31 U4_DRV1.32)
NetJ1_7: Main (J1.7), DRV1 (U4_DRV1.23 U4_DRV1.24 U4_DRV1.28 U4_DRV1.29)
NetJ2_1: Main (J2.1), DRV2 (U4_DRV2.2 U4_DRV2.3 U4_DRV2.7 U4_DRV2.8)
NetJ2_2: Main (J2.2), DRV2 (U4_DRV2.5 U4_DRV2.6 U4_DRV2.10 U4_DRV2.11)
NetJ2_6: Main (J2.6), DRV2 (U4_DRV2.26 U4_DRV2.27 U4_DRV2.31 U4_DRV2.32)
NetJ2_7: Main (J2.7), DRV2 (U4_DRV2.23 U4_DRV2.24 U4_DRV2.28 U4_DRV2.29)
NetJ3_1: Main (J3.1), DRV3 (U4_DRV3.2 U4_DRV3.3 U4_DRV3.7 U4_DRV3.8)
NetJ3_2: Main (J3.2), DRV3 (U4_DRV3.5 U4_DRV3.6 U4_DRV3.10 U4_DRV3.11)
NetJ3_6: Main (J3.6), DRV3 (U4_DRV3.26 U4_DRV3.27 U4_DRV3.31 U4_DRV3.32)
NetJ3_7: Main (J3.7), DRV3 (U4_DRV3.23 U4_DRV3.24 U4_DRV3.28 U4_DRV3.29)
NetU2_15: Main (U2.15), DRV1 (U4_DRV1.42)
NetU2_17: Main (U2.17), DRV1 (U4_DRV1.41)
NetU2_18: Main (U2.18), DRV2 (U4_DRV2.42)
NetU2_19: Main (U2.19), DRV3 (U4_DRV3.42)
NetU2_20: Main (U2.20), DRV3 (U4_DRV3.41)
NetU2_27: Main (U2.27), DRV2 (U4_DRV2.41)
SCK: Main (U1.26 U2.8 U3.17), DRV2 (U4_DRV2.16), DRV3 (U4_DRV3.16), DRV1 (U4_DRV1.16)